# EAGLE schematic barbi_pozoriste_master_revb (EAGLE 5.00)
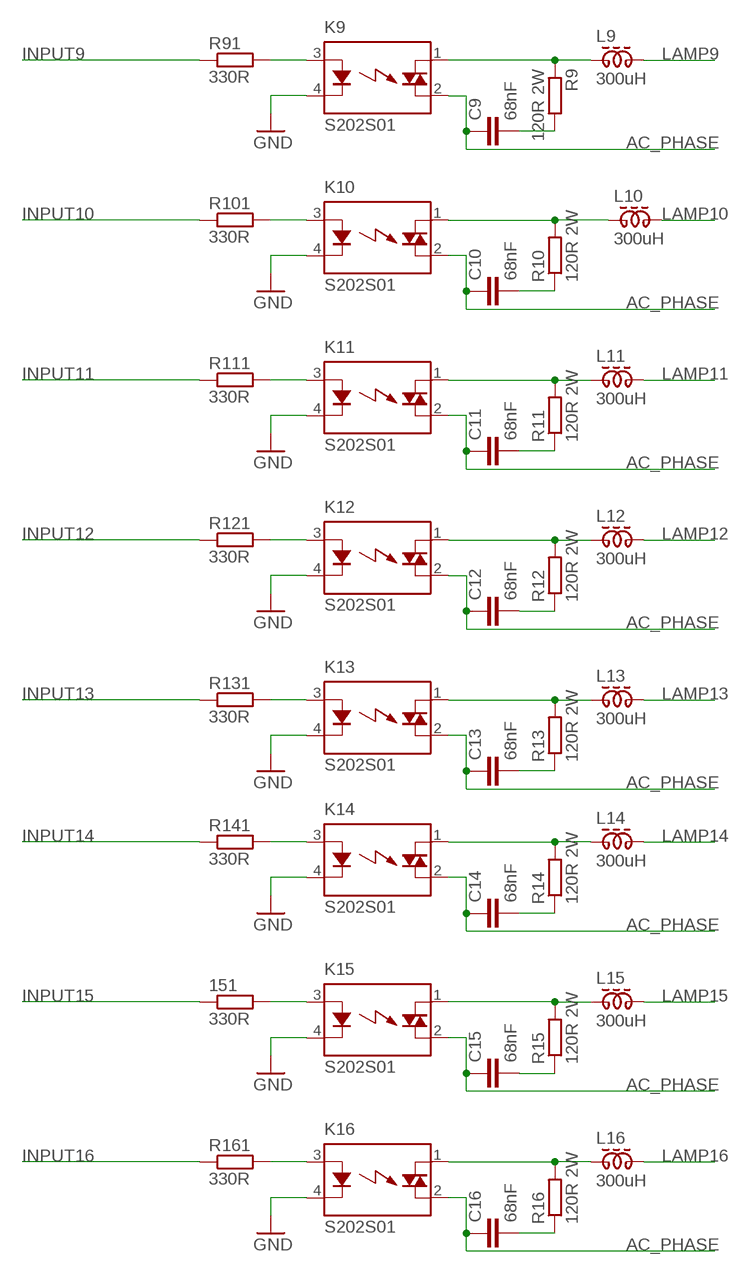
[diagram p0: schematic, sheet 1, part 1 of 2]
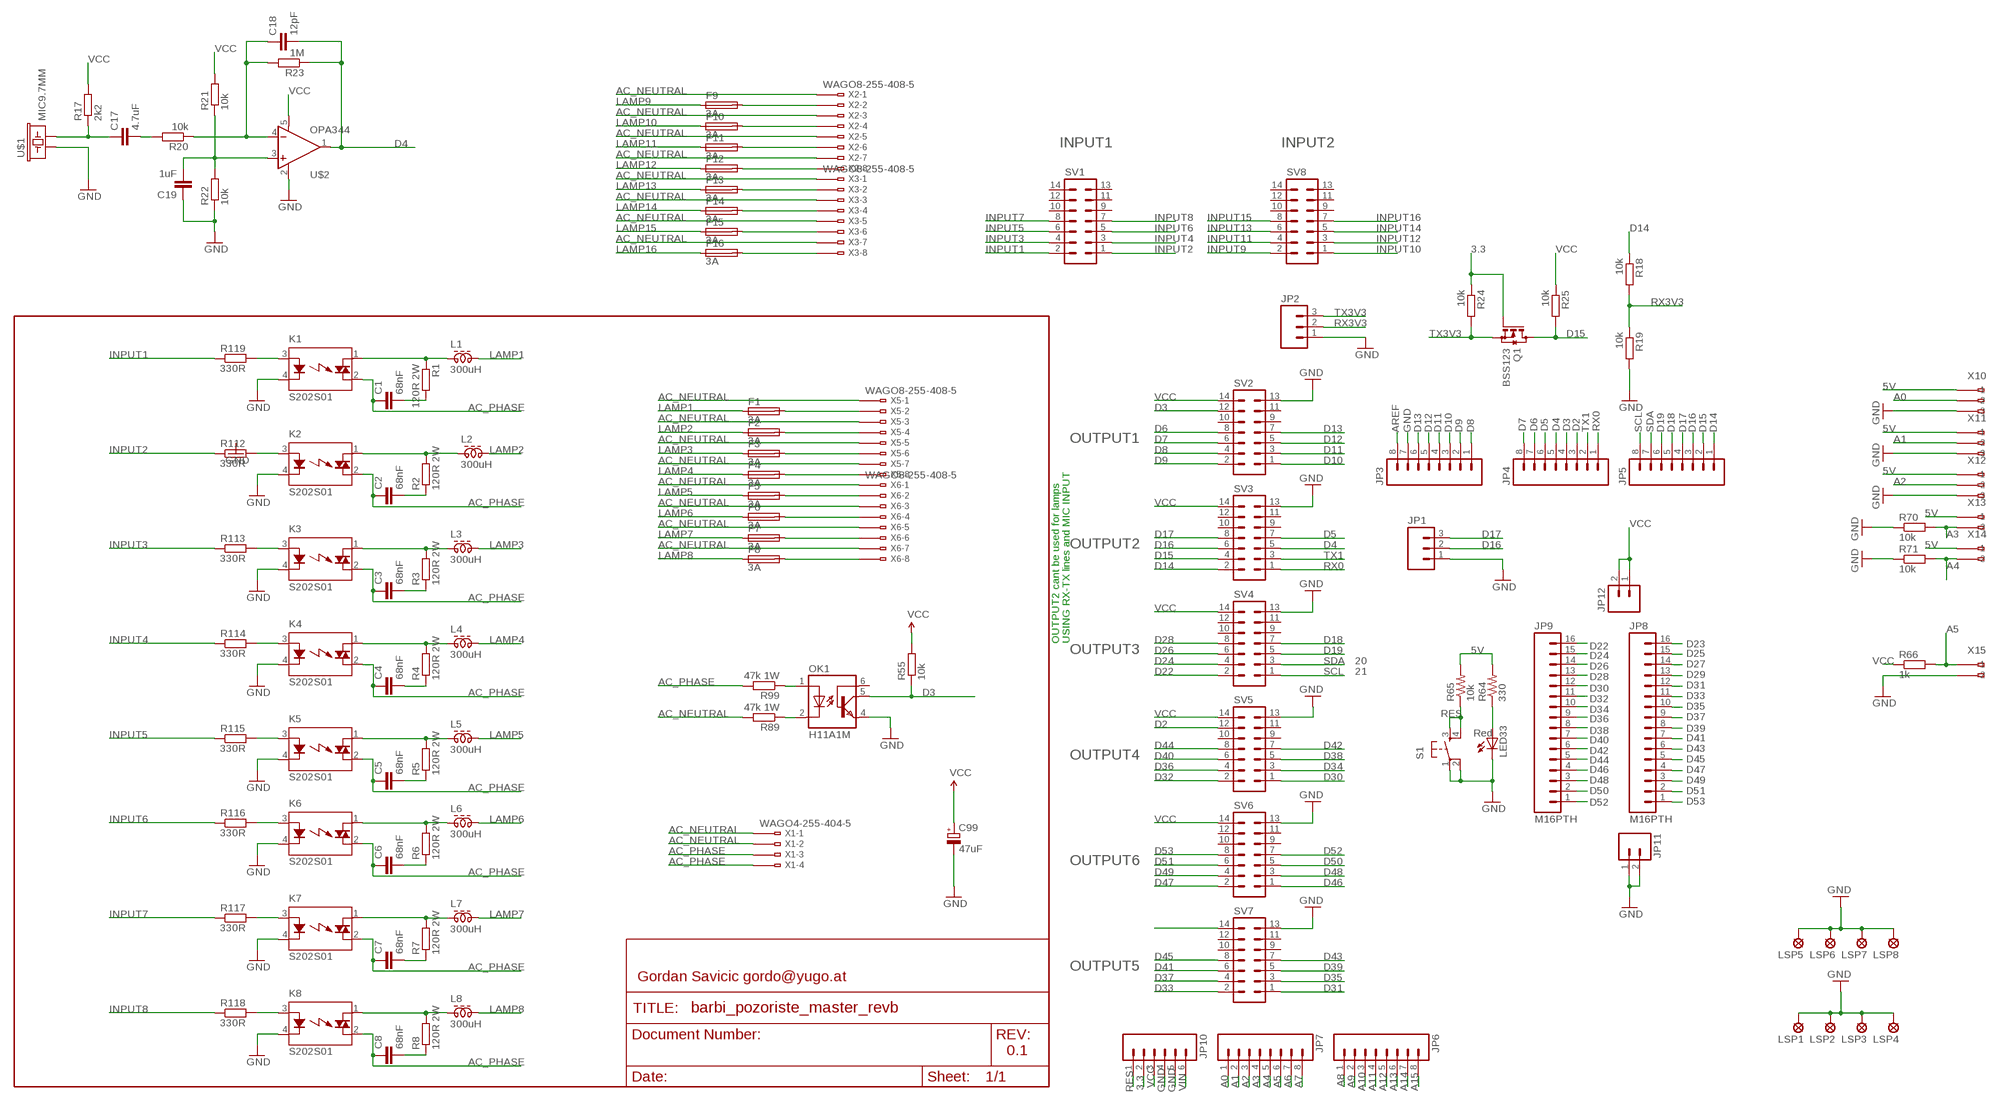
[diagram p1: schematic, sheet 1, part 2 of 2]

## Parts
151  330R  R-EU_M0805  [M0805]
C1  68nF  C-EU150-064X183  [C150-064X183]
C2  68nF  C-EU150-064X183  [C150-064X183]
C3  68nF  C-EU150-064X183  [C150-064X183]
C4  68nF  C-EU150-064X183  [C150-064X183]
C5  68nF  C-EU150-064X183  [C150-064X183]
C6  68nF  C-EU150-064X183  [C150-064X183]
C7  68nF  C-EU150-064X183  [C150-064X183]
C8  68nF  C-EU150-064X183  [C150-064X183]
C9  68nF  C-EU150-064X183  [C150-064X183]
C10  68nF  C-EU150-064X183  [C150-064X183]
C11  68nF  C-EU150-064X183  [C150-064X183]
C12  68nF  C-EU150-064X183  [C150-064X183]
C13  68nF  C-EU150-064X183  [C150-064X183]
C14  68nF  C-EU150-064X183  [C150-064X183]
C15  68nF  C-EU150-064X183  [C150-064X183]
C16  68nF  C-EU150-064X183  [C150-064X183]
C17  4.7uF  C-EUC0805  [C0805]
C18  12pF  C-EUC0805  [C0805]
C19  1uF  C-EUC0805  [C0805]
C99  47uF  CPOL-EUSMCC  [SMC_C]
F1  3A  SH22,5  [SH22,5]
F2  3A  SH22,5  [SH22,5]
F3  3A  SH22,5  [SH22,5]
F4  3A  SH22,5  [SH22,5]
F5  3A  SH22,5  [SH22,5]
F6  3A  SH22,5  [SH22,5]
F7  3A  SH22,5  [SH22,5]
F8  3A  SH22,5  [SH22,5]
F9  3A  SH22,5  [SH22,5]
F10  3A  SH22,5  [SH22,5]
F11  3A  SH22,5  [SH22,5]
F12  3A  SH22,5  [SH22,5]
F13  3A  SH22,5  [SH22,5]
F14  3A  SH22,5  [SH22,5]
F15  3A  SH22,5  [SH22,5]
F16  3A  SH22,5  [SH22,5]
JP1  M03PTH  [1X03]
JP2  M03PTH  [1X03]
JP3  M08  [1X08]
JP4  M08  [1X08]
JP5  M08  [1X08]
JP6  M08  [1X08]
JP7  M08  [1X08]
JP8  M16PTH  [1X16]
JP9  M16PTH  [1X16]
JP10  M06SIP  [1X06]
JP11  M02LOCK  [1X02_LOCK]
JP12  M02LOCK  [1X02_LOCK]
K1  S202S01  [S102S01]
K2  S202S01  [S102S01]
K3  S202S01  [S102S01]
K4  S202S01  [S102S01]
K5  S202S01  [S102S01]
K6  S202S01  [S102S01]
K7  S202S01  [S102S01]
K8  S202S01  [S102S01]
K9  S202S01  [S102S01]
K10  S202S01  [S102S01]
K11  S202S01  [S102S01]
K12  S202S01  [S102S01]
K13  S202S01  [S102S01]
K14  S202S01  [S102S01]
K15  S202S01  [S102S01]
K16  S202S01  [S102S01]
L1  300uH  ZD60820512  [ZD6-2W5]
L2  300uH  ZD60820512  [ZD6-2W5]
L3  300uH  ZD60820512  [ZD6-2W5]
L4  300uH  ZD60820512  [ZD6-2W5]
L5  300uH  ZD60820512  [ZD6-2W5]
L6  300uH  ZD60820512  [ZD6-2W5]
L7  300uH  ZD60820512  [ZD6-2W5]
L8  300uH  ZD60820512  [ZD6-2W5]
L9  300uH  ZD60820512  [ZD6-2W5]
L10  300uH  ZD60820512  [ZD6-2W5]
L11  300uH  ZD60820512  [ZD6-2W5]
L12  300uH  ZD60820512  [ZD6-2W5]
L13  300uH  ZD60820512  [ZD6-2W5]
L14  300uH  ZD60820512  [ZD6-2W5]
L15  300uH  ZD60820512  [ZD6-2W5]
L16  300uH  ZD60820512  [ZD6-2W5]
LED33  Red  LED0603  [LED-0603]
LSP1  MCS08  [MCS08]
LSP2  MCS08  [MCS08]
LSP3  MCS08  [MCS08]
LSP4  MCS08  [MCS08]
LSP5  MCS08  [MCS08]
LSP6  MCS08  [MCS08]
LSP7  MCS08  [MCS08]
LSP8  MCS08  [MCS08]
OK1  H11A1M  [DIL06]
Q1  BSS123  [SOT23]
R1  120R 2W  R-EU_0411/12  [0411/12]
R2  120R 2W  R-EU_0411/12  [0411/12]
R3  120R 2W  R-EU_0411/12  [0411/12]
R4  120R 2W  R-EU_0411/12  [0411/12]
R5  120R 2W  R-EU_0411/12  [0411/12]
R6  120R 2W  R-EU_0411/12  [0411/12]
R7  120R 2W  R-EU_0411/12  [0411/12]
R8  120R 2W  R-EU_0411/12  [0411/12]
R9  120R 2W  R-EU_0411/12  [0411/12]
R10  120R 2W  R-EU_0411/12  [0411/12]
R11  120R 2W  R-EU_0411/12  [0411/12]
R12  120R 2W  R-EU_0411/12  [0411/12]
R13  120R 2W  R-EU_0411/12  [0411/12]
R14  120R 2W  R-EU_0411/12  [0411/12]
R15  120R 2W  R-EU_0411/12  [0411/12]
R16  120R 2W  R-EU_0411/12  [0411/12]
R17  2k2  R-EU_R0805  [R0805]
R18  10k  R-EU_R0805  [R0805]
R19  10k  R-EU_R0805  [R0805]
R20  10k  R-EU_R0805  [R0805]
R21  10k  R-EU_R0805  [R0805]
R22  10k  R-EU_R0805  [R0805]
R23  1M  R-EU_R0805  [R0805]
R24  10k  R-EU_R0805  [R0805]
R25  10k  R-EU_R0805  [R0805]
R55  10k  R-EU_M0805  [M0805]
R64  330  RESISTOR  [0805]
R65  10k  RESISTOR  [0805]
R66  1k  R-EU_R0805  [R0805]
R70  10k  R-EU_R0805  [R0805]
R71  10k  R-EU_R0805  [R0805]
R89  47k 1W  R-EU_0207/12  [0207/12]
R91  330R  R-EU_M0805  [M0805]
R99  47k 1W  R-EU_0207/12  [0207/12]
R101  330R  R-EU_M0805  [M0805]
R111  330R  R-EU_M0805  [M0805]
R112  330R  R-EU_M0805  [M0805]
R113  330R  R-EU_M0805  [M0805]
R114  330R  R-EU_M0805  [M0805]
R115  330R  R-EU_M0805  [M0805]
R116  330R  R-EU_M0805  [M0805]
R117  330R  R-EU_M0805  [M0805]
R118  330R  R-EU_M0805  [M0805]
R119  330R  R-EU_M0805  [M0805]
R121  330R  R-EU_M0805  [M0805]
R131  330R  R-EU_M0805  [M0805]
R141  330R  R-EU_M0805  [M0805]
R161  330R  R-EU_M0805  [M0805]
S1  TAC_SWITCHPTH  [TACTILE-PTH]
SV1  ML14  [ML14]
SV2  ML14  [ML14]
SV3  ML14  [ML14]
SV4  ML14  [ML14]
SV5  ML14  [ML14]
SV6  ML14  [ML14]
SV7  ML14  [ML14]
SV8  ML14  [ML14]
U$1  MIC9.7MM  [MIC-9.7MM]
U$2  OPA344  [SOT23-5]
X1  WAGO4-255-404-5  [255-404-5]
X2  WAGO8-255-408-5  [255-408-5]
X3  WAGO8-255-408-5  [255-408-5]
X5  WAGO8-255-408-5  [255-408-5]
X6  WAGO8-255-408-5  [255-408-5]
X10  233-103  [233-103]
X11  233-103  [233-103]
X12  233-103  [233-103]
X13  233-102  [233-102]
X14  233-102  [233-102]
X15  233-102  [233-102]

## Nets
3.3: JP10.2 Q1.1(G) R24.1
5V: R64.2 R65.2 X10.A1(-1) X11.A1(-1) X12.A1(-1) X13.A1(-1) X14.A1(-1)
A0: JP7.1 X10.A2(-2)
A1: JP7.2 X11.A2(-2)
A2: JP7.3 X12.A2(-2)
A3: JP7.4 R70.2 X13.A2(-2)
A4: JP7.5 R71.2 X14.A2(-2)
A5: JP7.6 R66.2 X15.A1(-1)
A6: JP7.7
A7: JP7.8
A8: JP6.1
A9: JP6.2
A10: JP6.3
A11: JP6.4
A12: JP6.5
A13: JP6.6
A14: JP6.7
A15: JP6.8
AC_NEUTRAL: R89.2 X1.B1(-1:B1) X1.B2(-2:B1) X2.B1(-1:B1) X2.B3(-3:B1) X2.B5(-5:B1) X2.B7(-7:B1) X3.B1(-1:B1) X3.B3(-3:B1) X3.B5(-5:B1) X3.B7(-7:B1) X5.B1(-1:B1) X5.B3(-3:B1) X5.B5(-5:B1) X5.B7(-7:B1) X6.B1(-1:B1) X6.B3(-3:B1) X6.B5(-5:B1) X6.B7(-7:B1)
AC_PHASE: C1.1 C2.1 C3.1 C4.1 C5.1 C6.1 C7.1 C8.1 C9.1 C10.1 C11.1 C12.1 C13.1 C14.1 C15.1 C16.1 K1.2(DS2) K2.2(DS2) K3.2(DS2) K4.2(DS2) K5.2(DS2) K6.2(DS2) K7.2(DS2) K8.2(DS2) K9.2(DS2) K10.2(DS2) K11.2(DS2) K12.2(DS2) K13.2(DS2) K14.2(DS2) K15.2(DS2) K16.2(DS2) R99.2 X1.B3(-3:B1) X1.B4(-4:B1)
AREF: JP3.8
D2: JP4.3 SV5.12
D3: JP4.4 OK1.5(COL) R55.1 SV2.12
D4: C18.2 JP4.5 R23.1 SV3.5 U$2.1(OUT)
D5: JP4.6 SV3.7
D6: JP4.7 SV2.8
D7: JP4.8 SV2.6
D8: JP3.1 SV2.4
D9: JP3.2 SV2.2
D10: JP3.3 SV2.1
D11: JP3.4 SV2.3
D12: JP3.5 SV2.5
D13: JP3.6 SV2.7
D14: JP5.1 R18.1 SV3.2
D15: JP5.2 Q1.3(D) R25.2 SV3.4
D16: JP1.2 JP5.3 SV3.6
D17: JP1.3 JP5.4 SV3.8
D18: JP5.5 SV4.7
D19: JP5.6 SV4.5
D22: JP9.16 SV4.2
D23: JP8.16
D24: JP9.15 SV4.4
D25: JP8.15
D26: JP9.14 SV4.6
D27: JP8.14
D28: JP9.13 SV4.8
D29: JP8.13
D30: JP9.12 SV5.1
D31: JP8.12 SV7.1
D32: JP9.11 SV5.2
D33: JP8.11 SV7.2
D34: JP9.10 SV5.3
D35: JP8.10 SV7.3
D36: JP9.9 SV5.4
D37: JP8.9 SV7.4
D38: JP9.8 SV5.5
D39: JP8.8 SV7.5
D40: JP9.7 SV5.6
D41: JP8.7 SV7.6
D42: JP9.6 SV5.7
D43: JP8.6 SV7.7
D44: JP9.5 SV5.8
D45: JP8.5 SV7.8
D46: JP9.4 SV6.1
D47: JP8.4 SV6.2
D48: JP9.3 SV6.3
D49: JP8.3 SV6.4
D50: JP9.2 SV6.5
D51: JP8.2 SV6.6
D52: JP9.1 SV6.7
D53: JP8.1 SV6.8
GND: C19.1 C99.- JP1.1 JP2.1 JP3.7 JP10.4 JP10.5 JP11.1 JP11.2 K1.4(K) K2.4(K) K3.4(K) K4.4(K) K5.4(K) K6.4(K) K7.4(K) K8.4(K) K9.4(K) K10.4(K) K11.4(K) K12.4(K) K13.4(K) K14.4(K) K15.4(K) K16.4(K) LED33.C LSP1.MP LSP2.MP LSP3.MP LSP4.MP LSP5.MP LSP6.MP LSP7.MP LSP8.MP OK1.4(EMI) R19.2 R22.1 R70.1 R71.1 S1.1 S1.2 SV2.13 SV3.13 SV4.13 SV5.13 SV6.13 SV7.13 U$1.1 U$2.2(V-) X10.A3(-3) X11.A3(-3) X12.A3(-3) X15.A2(-2)
INPUT1: R119.1 SV1.2
INPUT2: R112.1 SV1.1
INPUT3: R113.1 SV1.4
INPUT4: R114.1 SV1.3
INPUT5: R115.1 SV1.6
INPUT6: R116.1 SV1.5
INPUT7: R117.1 SV1.8
INPUT8: R118.1 SV1.7
INPUT9: R91.1 SV8.2
INPUT10: R101.1 SV8.1
INPUT11: R111.1 SV8.4
INPUT12: R121.1 SV8.3
INPUT13: R131.1 SV8.6
INPUT14: R141.1 SV8.5
INPUT15: 151.1 SV8.8
INPUT16: R161.1 SV8.7
LAMP1: F1.1 L1.2
LAMP2: F2.1 L2.2
LAMP3: F3.1 L3.2
LAMP4: F4.1 L4.2
LAMP5: F5.1 L5.2
LAMP6: F6.1 L6.2
LAMP7: F7.1 L7.2
LAMP8: F8.1 L8.2
LAMP9: F9.1 L9.2
LAMP10: F10.1 L10.2
LAMP11: F11.1 L11.2
LAMP12: F12.1 L12.2
LAMP13: F13.1 L13.2
LAMP14: F14.1 L14.2
LAMP15: F15.1 L15.2
LAMP16: F16.1 L16.2
N$1: K2.1(DS1) L2.1 R2.2
N$2: K1.1(DS1) L1.1 R1.1
N$3: C1.2 R1.2
N$4: C2.2 R2.1
N$5: F4.2 X5.B8(-8:B1)
N$6: K3.1(DS1) L3.1 R3.2
N$7: OK1.1(A) R99.1
N$8: C3.2 R3.1
N$9: F1.2 X5.B2(-2:B1)
N$10: F2.2 X5.B4(-4:B1)
N$11: C4.2 R4.1
N$12: K4.1(DS1) L4.1 R4.2
N$13: K5.1(DS1) L5.1 R5.2
N$14: OK1.2(C) R89.1
N$15: C5.2 R5.1
N$16: F3.2 X5.B6(-6:B1)
N$17: K6.1(DS1) L6.1 R6.2
N$18: C6.2 R6.1
N$19: F5.2 X6.B2(-2:B1)
N$20: F8.2 X6.B8(-8:B1)
N$21: C7.2 R7.1
N$22: K7.1(DS1) L7.1 R7.2
N$23: K8.1(DS1) L8.1 R8.2
N$24: C8.2 R8.1
N$25: F7.2 X6.B6(-6:B1)
N$26: F6.2 X6.B4(-4:B1)
N$27: K2.3(A) R112.2
N$28: K3.3(A) R113.2
N$29: K4.3(A) R114.2
N$30: K5.3(A) R115.2
N$31: K6.3(A) R116.2
N$32: K7.3(A) R117.2
N$33: K8.3(A) R118.2
N$34: K1.3(A) R119.2
N$36: K10.3(A) R101.2
N$38: K11.3(A) R111.2
N$40: K12.3(A) R121.2
N$42: K13.3(A) R131.2
N$44: K14.3(A) R141.2
N$46: 151.2 K15.3(A)
N$48: K16.3(A) R161.2
N$50: K9.3(A) R91.2
N$59: K9.1(DS1) L9.1 R9.1
N$60: C9.2 R9.2
N$61: K10.1(DS1) L10.1 R10.2
N$62: C10.2 R10.1
N$63: K11.1(DS1) L11.1 R11.2
N$64: C11.2 R11.1
N$65: C12.2 R12.1
N$66: K12.1(DS1) L12.1 R12.2
N$67: K13.1(DS1) L13.1 R13.2
N$68: C13.2 R13.1
N$69: K14.1(DS1) L14.1 R14.2
N$70: C14.2 R14.1
N$71: C15.2 R15.1
N$72: K15.1(DS1) L15.1 R15.2
N$73: K16.1(DS1) L16.1 R16.2
N$74: C16.2 R16.1
N$75: C17.1 R17.1 U$1.2
N$79: C19.2 R21.1 R22.2 U$2.3(+IN)
N$80: C17.2 R20.2
N$81: C18.1 R20.1 R23.2 U$2.4(-IN)
N$139: F12.2 X2.B8(-8:B1)
N$140: F9.2 X2.B2(-2:B1)
N$141: F10.2 X2.B4(-4:B1)
N$142: F11.2 X2.B6(-6:B1)
N$143: F13.2 X3.B2(-2:B1)
N$144: F16.2 X3.B8(-8:B1)
N$145: F15.2 X3.B6(-6:B1)
N$146: F14.2 X3.B4(-4:B1)
N$163: LED33.A R64.1
RES: JP10.1 R65.1 S1.3 S1.4
RX0: JP4.1 SV3.1
RX3V3: JP2.2 R18.2 R19.1
SCL: JP5.8 SV4.1
SDA: JP5.7 SV4.3
TX1: JP4.2 SV3.3
TX3V3: JP2.3 Q1.2(S) R24.2
VCC: C99.+ JP10.3 JP12.1 JP12.2 R17.2 R21.2 R25.1 R55.2 R66.1 SV2.14 SV3.14 SV4.14 SV5.14 SV6.14 SV7.14 U$2.5(V+)
VIN: JP10.6
Unconnected: OK1.6(BAS) SV1.9 SV1.10 SV1.11 SV1.12 SV1.13 SV1.14 SV2.9 SV2.10 SV2.11 SV3.9 SV3.10 SV3.11 SV3.12 SV4.9 SV4.10 SV4.11 SV4.12 SV5.9 SV5.10 SV5.11 SV6.9 SV6.10 SV6.11 SV6.12 SV7.9 SV7.10 SV7.11 SV7.12 SV8.9 SV8.10 SV8.11 SV8.12 SV8.13 SV8.14 X1.A1(-1:A1) X1.A2(-2:A1) X1.A3(-3:A1) X1.A4(-4:A1) X2.A1(-1:A1) X2.A2(-2:A1) X2.A3(-3:A1) X2.A4(-4:A1) X2.A5(-5:A1) X2.A6(-6:A1) X2.A7(-7:A1) X2.A8(-8:A1) X3.A1(-1:A1) X3.A2(-2:A1) X3.A3(-3:A1) X3.A4(-4:A1) X3.A5(-5:A1) X3.A6(-6:A1) X3.A7(-7:A1) X3.A8(-8:A1) X5.A1(-1:A1) X5.A2(-2:A1) X5.A3(-3:A1) X5.A4(-4:A1) X5.A5(-5:A1) X5.A6(-6:A1) X5.A7(-7:A1) X5.A8(-8:A1) X6.A1(-1:A1) X6.A2(-2:A1) X6.A3(-3:A1) X6.A4(-4:A1) X6.A5(-5:A1) X6.A6(-6:A1) X6.A7(-7:A1) X6.A8(-8:A1) X10.B1(B-1) X10.B2(B-2) X10.B3(B-3) X11.B1(B-1) X11.B2(B-2) X11.B3(B-3) X12.B1(B-1) X12.B2(B-2) X12.B3(B-3) X13.B1(B-1) X13.B2(B-2) X14.B1(B-1) X14.B2(B-2) X15.B1(B-1) X15.B2(B-2)

## Notes on the sheet
- INPUT1 | INPUT2
- OUTPUT1
- OUTPUT2
- OUTPUT2 cant be used for lamps | USING RX-TX lines and MIC INPUT
- OUTPUT3
- 20
- 21
- OUTPUT4
- OUTPUT6
- OUTPUT5
- Gordan Savicic gordo@yugo.at
- 0.1

## Library data of the parts
151 R1-R25 R55 R66 R70 R71 R89 R91 R99 R101 R111-R119 R121 R131 R141 R161 = rcl:R-EU_: RESISTOR, European symbol
C1-C19 = rcl:C-EU: CAPACITOR, European symbol
C99 = rcl:CPOL-EU: POLARIZED CAPACITOR, European symbol
F1-F16 = fuse:SH22,5: FUSE HOLDER grid 22,5 mm, OGN0031 8201, Schurter (Buerklin)
JP1 JP2 = SparkFun:M03: Header 3 Standard 3-pin 0.1" header. Use with straight break away headers (SKU : PRT-00116), right angle break away headers (PRT-00553), swiss pins (PRT-00743), machine pins (PRT-00117), and female headers (PRT-00115). Molex polarized connector foot print use with SKU : PRT-08232 with associated crimp pins and housings.
JP3-JP7 = SparkFun:M08: Header 8 Standard 8-pin 0.1" header. Use with straight break away headers (SKU : PRT-00116), right angle break away headers (PRT-00553), swiss pins (PRT-00743), machine pins (PRT-00117), and female headers (PRT-00115).
JP8 JP9 = SparkFun:M16
JP10 = SparkFun:M06: Header 6 Standard 6-pin 0.1" header. Use with straight break away headers (SKU : PRT-00116), right angle break away headers (PRT-00553), swiss pins (PRT-00743), machine pins (PRT-00117), and female headers (PRT-00115). Molex polarized connector foot print use with SKU : PRT-08094 with associated crimp pins and housings. NOTES ON THE VARIANTS LOCK and LOCK_LONGPADS... This footprint was designed to help hold the alignment of a through-hole component (i.e. 6-pin header) while soldering it into place. You may notice that each hole has been shifted either up or down by 0.005 of an inch from it's more standard position (which is a perfectly straight line). This slight alteration caused the pins (the squares in the middle) to touch the edges of the holes. Because they are alternating, it causes a "brace" to hold the component in place. 0.005 has proven to be the perfect amount of "off-center" position when using our standard breakaway headers. Although looks a little odd when you look at the bare footprint, once you have a header in there, the alteration is very hard to notice. Also, if you push a header all the way into place, it is covered up entirely on the bottom side. This idea of altering the position of holes to aid alignment will be further integrated into the Sparkfun Library for other footprints. It can help hold any component with 3 or more connection pins.
JP11 JP12 = SparkFun:M02: Header 2 Standard 2-pin 0.1" header. Use with straight break away headers (SKU : PRT-00116), right angle break away headers (PRT-00553), swiss pins (PRT-00743), machine pins (PRT-00117), and female headers (PRT-00115). Molex polarized connector foot print use with SKU : PRT-08233 with associated crimp pins and housings.
K1-K16 = relay:S?*: Low Height Type Solid State Relays SHARP Source: 162574-da-01-en-S202T02_Solid_State_Relais.pdf Source: http://sharp-world.com .. s102s11_e.pdf
L1-L16 = inductor-neosid:ZD60820512: WIDE-BAND CHOKE 2.5 windings
LED33 = SparkFun:LED: LEDs Standard schematic elements and footprints for 5mm, 3mm, 1206, and 0603 sized LEDs. 5mm - Spark Fun Electronics SKU : COM-00529 (and others)
LSP1-LSP8 = solpad:MCS08: SOLDER PAD MC S0,8, drill 1.2 mm, distributor Buerklin, 08F130
OK1 = optocoupler:H11A*?M: General Purpose 6-Pin Phototransistor Optocouplers Source: http://www.fairchildsemi.com/ds/4N/4N35-M.pdf
Q1 = transistor-small-signal:BSS123: N-CHANNEL MOS FET
R64 R65 = SparkFun:RESISTOR: Resistor Basic schematic elements and footprints for 0603, 1206, and PTH 1/10th watt (small) resistors.
S1 = SparkFun:TAC_SWITCH: Momentary Switch Button commonly used for reset or general input. Spark Fun Electronics SKU : COM-00097
SV1-SV8 = con-ml:ML14: HARTING
U$1 = SparkFun:MIC: Microphone Omni-directional electret microphone. 9.7mm standard diameter.
U$2 = SparkFun:OPA344
X1 = con-wago:WAGO4-: WAGO Cage Clamp
X2 X3 X5 X6 = con-wago:WAGO8-: WAGO Cage Clamp
X10-X12 = con-wago:233-103: WAGO Cage Clamp
X13-X15 = con-wago:233-102: WAGO Cage Clamp